# Altium schematic sheet MPU.SchDoc
size A4
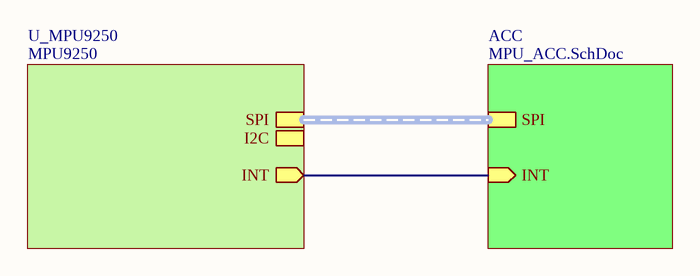
[diagram p0: MPU.SchDoc]

## Sub-sheets
ACC = MPU_ACC.SchDoc: SPI, INT (in)
U_MPU9250 = MPU9250: INT (out), SPI (harness SPI), I2C (harness SPI)

## Nets
(unnamed): sheet ACC/INT, sheet U_MPU9250/INT

## Buses and harness runs
harness sheet ACC/SPI = sheet U_MPU9250/SPI